# Altium schematic sheet DCI_Ethernet.SchDoc
size 420 x 297 mm; ENG_APP_DATE: --/--/--; DSN_APP_DATE: --/--/--; CHK_APP_DATE: --/--/--
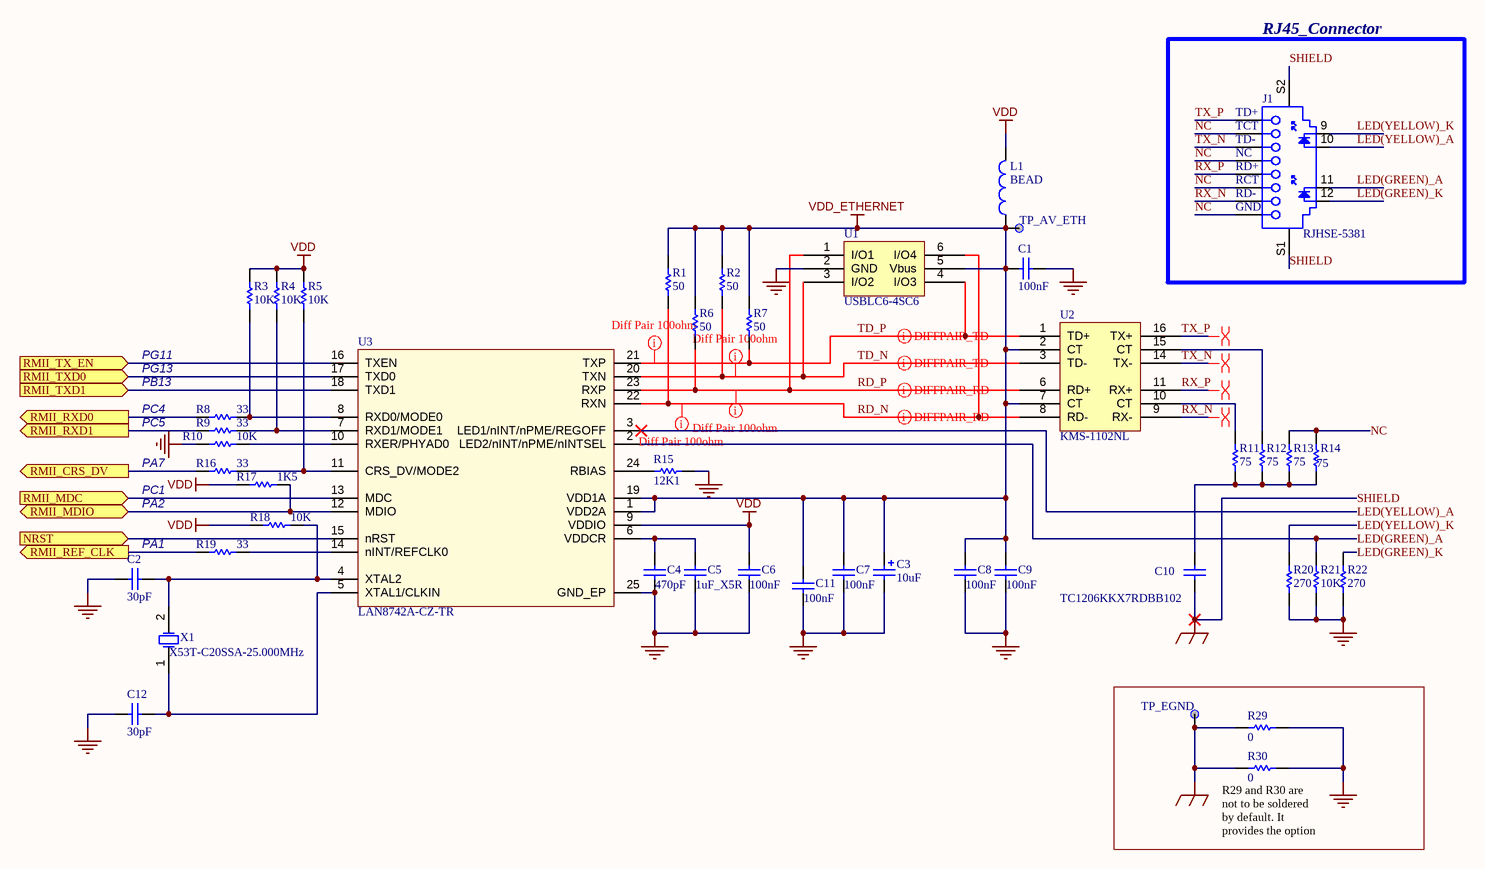
[diagram p0: DCI_Ethernet.SchDoc]

## Parts
C1  100nF  [0603C]
C2  30pF  [0603C]
C3  10uF  [TAN-A - XDown]
C4  470pF  [0603C]
C5  1uF_X5R  [0603C]
C6  100nF  [0603C]
C7  100nF  [0603C]
C8  100nF  [0603C]
C9  100nF  [0603C]
C10  TC1206KKX7RDBB102  [1206C]
C11  100nF  [0603C]
C12  30pF  [0603C]
J1  RJHSE-5381  [AMPH-RJHSE-5381_V]
L1  BEAD  [0603L]
R1  50  [0603R]
R2  50  [0603R]
R3  10K  [0603R]
R4  10K  [0603R]
R5  10K  [0603R]
R6  50  [0603R]
R7  50  [0603R]
R8  33  [0603R]
R9  33  [0603R]
R10  10K  [0603R]
R11  75  [0603R]
R12  75  [0603R]
R13  75  [0603R]
R14  75  [0603R]
R15  12K1  [0603R]
R16  33  [0603R]
R17  1K5  [0603R]
R18  10K  [0603R]
R19  33  [0603R]
R20  270  [0603R]
R21  10K  [0603R]
R22  270  [0603R]
R29  0  [0603R]
R30  0  [0603R]
TP_AV_ETH  TP_AVDD_ETH  [TP]  (value not drawn)
TP_EGND  TP_EGND  [TP]  (value not drawn)
U1  USBLC6-4SC6  [SOT23-6L]
U2  KMS-1102NL  [Transformer]
U3  LAN8742A-CZ-TR  [QFN24_0R5_4X4]
X1  X53T-C20SSA-25.000MHz  [XTAL_2SM_5R0X3R2]

## Blocks framed on the sheet
RJ45_Connector: J1

## Ports
NRST (in), RMII_CRS_DV (out), RMII_MDC (in), RMII_MDIO (bidir), RMII_REF_CLK (out), RMII_RXD0 (out), RMII_RXD1 (out), RMII_TX_EN (in), RMII_TXD0 (in), RMII_TXD1 (in)

## Nets
GND: C1.1 C2.2 C3.2 C4.1 C5.2 C6.1 C7.1 C8.1 C9.1 C11.1 C12.2 R10.2 R15.2 R20.2 R21.2 R22.2 R29.1 R30.1 U1.2(GND) U3.25(GND_EP)
SHIELD: C10.1 J1.S1 J1.S2 R29.2 R30.2 TP_EGND.1  [also labelled EGND]
VDD: C6.2 L1.2 R3.1 R4.1 R5.1 R17.2 R18.1 U3.9(VDDIO)
VDD_ETHERNET: C1.2 C3.1 C7.2 C8.2 C9.2 C11.2 L1.1 R1.2 R2.2 R6.2 R7.2 TP_AV_ETH.1 U1.5(Vbus) U2.2(CT) U2.7(CT) U3.1(VDD2A) U3.19(VDD1A)
LED(GREEN)_A: J1.11 R21.1 U3.2(LED2/nINT/nPME/nINTSEL)
LED(GREEN)_K: J1.12 R22.1
LED(YELLOW)_A: J1.10 U3.3(LED1/nINT/nPME/REGOFF)
LED(YELLOW)_K: J1.9 R20.1
NC: J1.2(TCT) J1.4(NC) J1.6(RCT) J1.8(GND) R13.2 R14.2
NRST: U3.15(nRST) ; port NRST
RD_N: R1.1 U1.6(I/O4) U2.8(RD-) U3.22(RXN)
RD_P: R6.1 U1.1(I/O1) U2.6(RD+) U3.23(RXP)
RMII_CRS_DV: R16.2 ; port RMII_CRS_DV
RMII_MDC: U3.13(MDC) ; port RMII_MDC
RMII_MDIO: R17.1 U3.12(MDIO) ; port RMII_MDIO
RMII_REF_CLK: R19.2 ; port RMII_REF_CLK
RMII_RXD0: R8.2 ; port RMII_RXD0
RMII_RXD1: R9.2 ; port RMII_RXD1
RMII_TX_EN: U3.16(TXEN) ; port RMII_TX_EN
RMII_TXD0: U3.17(TXD0) ; port RMII_TXD0
RMII_TXD1: U3.18(TXD1) ; port RMII_TXD1
RX_N: J1.7(RD-) U2.9(RX-)
RX_P: J1.5(RD+) U2.11(RX+)
TD_N: R2.1 U1.3(I/O2) U2.3(TD-) U3.20(TXN)
TD_P: R7.1 U1.4(I/O3) U2.1(TD+) U3.21(TXP)
TX_N: J1.3(TD-) U2.14(TX-)
TX_P: J1.1(TD+) U2.16(TX+)
NetC2_1: C2.1 R18.2 U3.4(XTAL2) X1.2(OSC2)
NetC4_2: C4.2 C5.1 U3.6(VDDCR)
NetC10_2: C10.2 R11.1 R12.1 R13.1 R14.1
NetC12_1: C12.1 U3.5(XTAL1/CLKIN) X1.1(OSC1)
NetR3_2: R3.2 R8.1 U3.8(RXD0/MODE0)
NetR4_2: R4.2 R9.1 U3.7(RXD1/MODE1)
NetR5_2: R5.2 R16.1 U3.11(CRS_DV/MODE2)
NetR10_1: R10.1 U3.10(RXER/PHYAD0)
NetR11_2: R11.2 U2.10(CT)
NetR12_2: R12.2 U2.15(CT)
NetR15_1: R15.1 U3.24(RBIAS)
NetR19_1: R19.1 U3.14(nINT/REFCLK0)

## Layout directives
differential pair: RD_N, RD_P, RX_N, RX_P, TD_N, TD_P, TX_N, TX_P
rule Matched Net Lengths [Tolerance = 100mil]: RD_N, RD_P, TD_N, TD_P

## Notes on the sheet
- PG11
- PG13
- PB13
- PC4
- PC5
- PA7
- PC1
- PA2
- (near C2) PA1
- (near R30) R29 and R30 are not to be soldered by default. It provides the option of it being present to the final user. Therefore, only the footprint will be present in the final assembly
- MEMBERS:
- Universitat Politècnica de València
- - Gianmarco Leopoldo Sangoi
- - Vicente Beltrán Morte
- PROJECT:
- SIZE:
- FILE NAME:
- A3
- NUMBER:
- 4
- REVISION:
- A1
- DATE:
- 07/05/2022
- SHEET
- OF
- 7

## Library data of the parts
C1 C6-C9 C11 = Capacitor_ST: Capacitor 0402 / 0603 / 0805; Revision: July-2002: Re-released for DXP Platform.; Value: 100nF
C2 C4 C12 = Capacitor_ST: Capacitor 0402 / 0603 / 0805; Value: 100nF; Revision: July-2002: Re-released for DXP Platform.
C3 = Cap_10uF_POL_10%_TANA: Polarized Capacitor,10uF,10V,10%,typeA,VISHAY; Manuf_Part_1: 293D106X9010A2TE3; Revision: July-2002: Re-released for DXP Platform.; Value: 10uF; Manuf_1: VISHAY; Order: *; ECCN_US/EU: n/a
C5 = CAP SMD 0603  X5R 1µF 25V 10%: 0603  X5R 1µF; Rated voltage: 25V; Tolerance: 10%; Manufacturer: *; Manufacturer P/N: *; Order code Farnell: 1288202RL; Value: 1µF; Power: *; Technology: X5R; Temperature  Factor: *; Temperature Max: +125°C; Temperature Min: -55°C; STS Code: *
C10 = Capacitor_ST: Capacitor 0402 / 0603 / 0805/ 1206; Value: 100nF; Revision: July-2002: Re-released for DXP Platform.
J1 = CMP-2000-06980-1: High Speed RJ45, Modular Jack, 8 Position, 8 Contacts, Shielded, with LEDs, -55 to 85 degC,12-Pin THD, RoHS, Tray; Manufacturer: Amphenol; Number of Positions/Contacts: 8p8c(RJ45,Ethernet); Number of Ports: 1; Catalog Drawings: RJ45SeriesRightAngle; PCN Design/Specification: MultipleSeriesCopper29/Jan/2009RJHSEShieldMaterial30/Jun/2015; Other Names: RJHSE5381; Online Catalog: RJHSESeries; Featured Product: ModularJacksProductSolutions; Tab Direction: Up; Shielding: Shielded,EMIFinger; LED Color: Yellow-Green; 3D Model: RJHSE538x.stpRJHSE538x.igs; Category: Connectors,Interconnects; Termination: Solder; Housing Material: Thermoplastic; Mounting Type: ThroughHole; Family: ModularConnectors-Jacks; Orientation: 90°Angle(Right); Features: BoardLock; Contact Material: PhosphorBronze; Mounting Technology: ThroughHole; Number of Rows: 1; Standard Package: 120; Ratings: -; Operating Temperature: -55°C~85°C; Series: RJHSE; Contact Finish: Gold; Package Reference: RJHSE-5381; Ingress Protection: -; Package Description: 12-Pin Through Hole Device, Body 16.51 x 15.75 mm; Contact Finish Thickness: 50µin(1.27µm); Datasheet URL: https://datasheet.ciiva.com/16481/rjhse538x-16481714.pdf; Datasheet Version: Rev. K, 04/2014; Connector Type: Jack; Manufacturer URL: http://www.amphenol.com/; Packaging: Tray
L1 = Inductor: Value: 100uH; Published: 8-Jun-2000; Revision: July-2002: Re-released for DXP Platform.; Publisher: Altium Limited
R1 R2 R6 R7 = Res_50_1%_0603: Resistor,50,0603,1%,YAGEO; Manuf_Part_1: RC0402FR-0750RL; Value: 50; Manuf_1: YAGEO; Order: *; ECCN_US/EU: n/a; Distrib: FARNELL
R3-R5 R10 R18 R21 = Resistor_ST: Resistor 0402 / 0603 / 0805; Value: 10K
R8 R9 R16 R19 = Res_33_1%_0402: Resistor,33,0402,1%,YAGEO; Manuf_Part_1: RC0402FR-0733RL; Value: 33; Manuf_1: YAGEO; Order: *; ECCN_US/EU: n/a; Distrib: FARNELL
R11-R14 = Res_75_1%_0603: Resistor,75,0603,1%,YAGEO; Manuf_Part_1: RC0402FR-0750RL; Value: 50; Manuf_1: YAGEO; Order: *; ECCN_US/EU: n/a; Distrib: FARNELL
R15 = Res_12K1_1%_0603: Resistor,12K1,0603,1%,VISHAY; Manuf_Part_1: MCT 0603-50 1% P5 12K1; Order: 2325243; Value: 12K1; ECCN_US/EU: n/a; Manuf_1: VISHAY; Distrib: FARNELL
R17 = Res_1K5_1%_0402: Resistor,1K5,0402,1%,YAGEO; Manuf_Part_1: RC0402FR-071K5L; Value: 1K5; Manuf_1: YAGEO; Order: RC0402FR-071K5L; ECCN_US/EU: n/a; Distrib: FARNELL
R20 R22 = Resistor_ST: Resistor 0402 / 0603 / 0805; Value: 10K
R29 R30 = Res1: Resistor; Value: 1K; Ordered by: Subcon; Published: 8-Jun-2000; Revision: July-2002: Re-released for DXP Platform.; Publisher: Altium Limited
TP_AV_ETH TP_EGND = TP
U3 = LAN8742A-CZ-TR: LAN8742A-CZ-TR - Small Footprint RMII 10/100 Ethernet, Transceiver with HP Auto-MDIX and flexPWR Technology SQFN-24; Manuf_1: MICROCHIP; Order: LAN8742A-CZ-TR; Manuf_Part_1: LAN8742A-CZ-TR; Distrib: MICROCHIP
X1 = XTAL_5032: Crystal Oscillator; Published: 8-Jun-2000; LatestRevisionDate: 17-Jul-2002; LatestRevisionNote: Re-released for DXP Platform.; PackageReference: R38; Publisher: Altium Limited